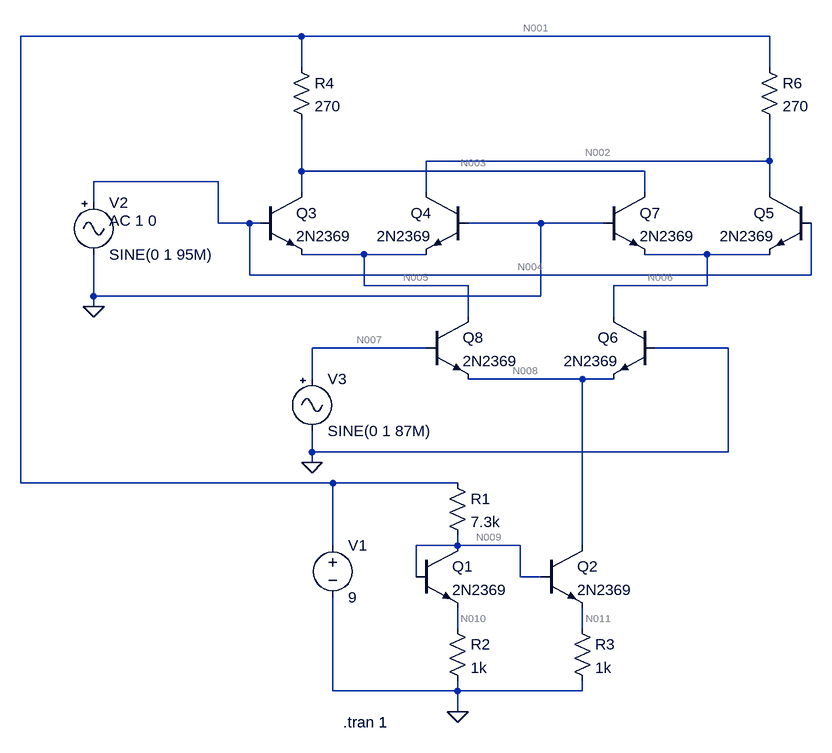
[diagram p0: schematic mixer.asc]
mixer.asc, the LTspice schematic file:
Version 4
SHEET 1 936 680
WIRE 80 -848 -352 -848
WIRE 800 -848 80 -848
WIRE 80 -800 80 -848
WIRE 800 -800 800 -848
WIRE 800 -656 800 -720
WIRE 800 -656 272 -656
WIRE 80 -640 80 -720
WIRE 608 -640 80 -640
WIRE -48 -624 -240 -624
WIRE 80 -608 80 -640
WIRE 272 -608 272 -656
WIRE 608 -608 608 -640
WIRE 800 -608 800 -656
WIRE -240 -592 -240 -624
WIRE -48 -560 -48 -624
WIRE 0 -560 -48 -560
WIRE 16 -560 0 -560
WIRE 448 -560 336 -560
WIRE 544 -560 448 -560
WIRE 176 -512 80 -512
WIRE 272 -512 176 -512
WIRE 704 -512 608 -512
WIRE 800 -512 704 -512
WIRE 0 -480 0 -560
WIRE 864 -480 864 -560
WIRE 864 -480 0 -480
WIRE 176 -464 176 -512
WIRE 336 -464 176 -464
WIRE 704 -464 704 -512
WIRE 704 -464 560 -464
WIRE -240 -448 -240 -512
WIRE 448 -448 448 -560
WIRE 448 -448 -240 -448
WIRE -240 -432 -240 -448
WIRE 336 -416 336 -464
WIRE 560 -416 560 -464
WIRE 272 -368 96 -368
WIRE 736 -368 624 -368
WIRE 96 -320 96 -368
WIRE 512 -320 336 -320
WIRE 560 -320 512 -320
WIRE 96 -208 96 -240
WIRE 736 -208 736 -368
WIRE 736 -208 96 -208
WIRE 96 -192 96 -208
WIRE -352 -160 -352 -848
WIRE 128 -160 -352 -160
WIRE 320 -160 128 -160
WIRE 128 -64 128 -160
WIRE 320 -64 320 -80
WIRE 320 -64 256 -64
WIRE 416 -64 320 -64
WIRE 512 -64 512 -320
WIRE 256 -16 256 -64
WIRE 416 -16 416 -64
WIRE 448 -16 416 -16
WIRE 320 64 320 32
WIRE 512 64 512 32
WIRE 128 160 128 16
WIRE 320 160 320 144
WIRE 320 160 128 160
WIRE 512 160 512 144
WIRE 512 160 320 160
WIRE 320 192 320 160
FLAG 320 192 0
FLAG -240 -432 0
FLAG 96 -192 0
SYMBOL npn 256 -64 R0
SYMATTR InstName Q1
SYMATTR Value 2N2369
SYMBOL res 304 -176 R0
SYMATTR InstName R1
SYMATTR Value 7.3k
SYMBOL res 304 48 R0
SYMATTR InstName R2
SYMATTR Value 1k
SYMBOL res 496 48 R0
SYMATTR InstName R3
SYMATTR Value 1k
SYMBOL npn 448 -64 R0
SYMATTR InstName Q2
SYMATTR Value 2N2369
SYMBOL voltage 128 -80 R0
SYMATTR InstName V1
SYMATTR Value 9
SYMBOL npn 16 -608 R0
SYMATTR InstName Q3
SYMATTR Value 2N2369
SYMBOL npn 336 -608 M0
SYMATTR InstName Q4
SYMATTR Value 2N2369
SYMBOL res 784 -816 R0
SYMATTR InstName R6
SYMATTR Value 270
SYMBOL npn 864 -608 M0
SYMATTR InstName Q5
SYMATTR Value 2N2369
SYMBOL npn 624 -416 M0
SYMATTR InstName Q6
SYMATTR Value 2N2369
SYMBOL npn 544 -608 R0
SYMATTR InstName Q7
SYMATTR Value 2N2369
SYMBOL npn 272 -416 R0
SYMATTR InstName Q8
SYMATTR Value 2N2369
SYMBOL Misc\\signal -240 -608 R0
WINDOW 123 24 44 Left 2
WINDOW 39 0 0 Left 0
SYMATTR Value2 AC 1 0
SYMATTR InstName V2
SYMATTR Value SINE(0 1 95M)
SYMBOL Misc\\signal 96 -336 R0
WINDOW 123 0 0 Left 0
WINDOW 39 0 0 Left 0
SYMATTR InstName V3
SYMATTR Value SINE(0 1 87M)
SYMBOL res 64 -816 R0
SYMATTR InstName R4
SYMATTR Value 270
TEXT 144 208 Left 2 !.tran 1

The netlist it stands for:
* mixer.asc
Q1 N009 N009 N010 0 2N2369
R1 N001 N009 7.3k
R2 N010 0 1k
R3 N011 0 1k
Q2 N008 N009 N011 0 2N2369
V1 N001 0 9
Q3 N003 N004 N005 0 2N2369
Q4 N002 0 N005 0 2N2369
R6 N001 N002 270
Q5 N002 N004 N006 0 2N2369
Q6 N006 0 N008 0 2N2369
Q7 N003 0 N006 0 2N2369
Q8 N005 N007 N008 0 2N2369
V2 N004 0 SINE(0 1 95M) AC 1 0
V3 N007 0 SINE(0 1 87M)
R4 N001 N003 270
.model NPN NPN
.model PNP PNP
.lib standard.bjt
.tran 1
.backanno
.end

* Results of the author's LTspice run, read from the files saved beside the schematic
* Operating Point, zero values left out:
*   V(n009) = 1.142 V
*   V(n010) = 541 mV
*   V(n001) = 9 V
*   V(n011) = 535.5 mV
*   V(n008) = 649 mV
*   V(n003) = 9 V
*   V(n005) = 965.2 µV
*   V(n002) = 9 V
*   V(n006) = 965.2 µV
*   Ic(Q7) = 12.53 pA
*   Ib(Q7) = -12.48 pA
*   Ic(Q5) = 12.53 pA
*   Ib(Q5) = -12.48 pA
*   Ic(Q4) = 12.53 pA
*   Ib(Q4) = -12.48 pA
*   Ic(Q3) = 12.53 pA
*   Ib(Q3) = -12.48 pA
*   Ic(Q2) = -1.568 pA
*   Ib(Q2) = 535.5 µA
*   Ie(Q2) = -535.5 µA
*   Ic(Q1) = 532.5 µA
*   Ib(Q1) = 8.477 µA
*   Ie(Q1) = -541 µA
*   I(R4) = 25.05 pA
*   I(R6) = 25.05 pA
*   I(R3) = 535.5 µA
*   I(R2) = 541 µA
*   I(R1) = 1.077 mA
*   I(V2) = 24.96 pA
*   I(V1) = -1.077 mA
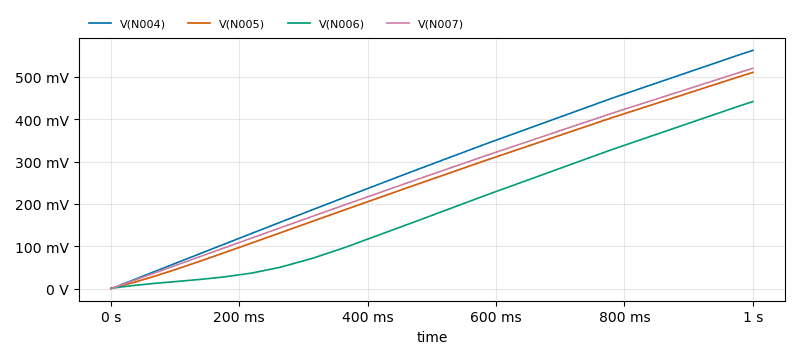
[diagram p1: Transient Analysis of mixer.asc, plotted from the saved traces]
* Transient Analysis, 1 run:
*   V(N004): min 0 V, max 562.1 mV, average 289.5 mV, rms 333.6 mV, last 562.1 mV
*   V(N005): min 965.2 µV, max 510.1 mV, average 256 mV, rms 298.1 mV, last 510.1 mV
*   V(N006): min 965.2 µV, max 441.5 mV, average 186.6 mV, rms 234.9 mV, last 441.5 mV
*   V(N007): min 0 V, max 519.8 mV, average 266.4 mV, rms 307.3 mV, last 519.8 mV